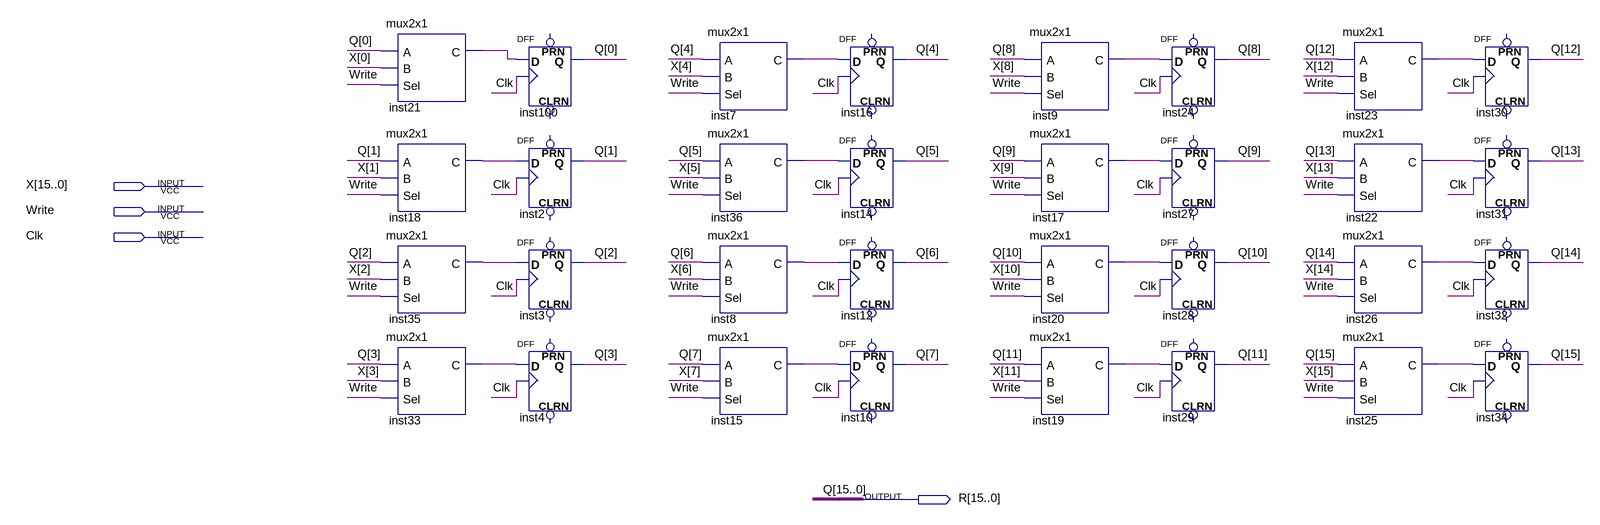
[diagram p0: schematic sheet]
// Quartus schematic reg2.bdf as structural Verilog: 32 symbols, 4 pins
module reg2 (
  input  [15:0] X,
  input  Write,
  input  Clk,
  output [15:0] R
);

  wire inst7_c, inst8_c, inst9_c, inst15_c, inst17_c, inst18_c, inst19_c, inst20_c, inst21_c, inst22_c,
       inst23_c, inst25_c, inst26_c, inst33_c, inst35_c, inst36_c;

  mux2x1 inst21 (.A(R[0]), .B(X[0]), .Sel(Write), .C(inst21_c));
  mux2x1 inst18 (.A(R[1]), .B(X[1]), .Sel(Write), .C(inst18_c));
  mux2x1 inst35 (.A(R[2]), .B(X[2]), .Sel(Write), .C(inst35_c));
  mux2x1 inst33 (.A(R[3]), .B(X[3]), .Sel(Write), .C(inst33_c));
  DFF inst100 (.CLK(Clk), .D(inst21_c), .Q(R[0]));  // open: CLRN, PRN
  DFF inst2 (.CLK(Clk), .D(inst18_c), .Q(R[1]));  // open: CLRN, PRN
  DFF inst3 (.CLK(Clk), .D(inst35_c), .Q(R[2]));  // open: CLRN, PRN
  DFF inst4 (.CLK(Clk), .D(inst33_c), .Q(R[3]));  // open: CLRN, PRN
  mux2x1 inst7 (.A(R[4]), .B(X[4]), .Sel(Write), .C(inst7_c));
  mux2x1 inst36 (.A(R[5]), .B(X[5]), .Sel(Write), .C(inst36_c));
  mux2x1 inst8 (.A(R[6]), .B(X[6]), .Sel(Write), .C(inst8_c));
  mux2x1 inst15 (.A(R[7]), .B(X[7]), .Sel(Write), .C(inst15_c));
  DFF inst16 (.CLK(Clk), .D(inst7_c), .Q(R[4]));  // open: CLRN, PRN
  DFF inst14 (.CLK(Clk), .D(inst36_c), .Q(R[5]));  // open: CLRN, PRN
  DFF inst12 (.CLK(Clk), .D(inst8_c), .Q(R[6]));  // open: CLRN, PRN
  DFF inst10 (.CLK(Clk), .D(inst15_c), .Q(R[7]));  // open: CLRN, PRN
  mux2x1 inst9 (.A(R[8]), .B(X[8]), .Sel(Write), .C(inst9_c));
  mux2x1 inst17 (.A(R[9]), .B(X[9]), .Sel(Write), .C(inst17_c));
  mux2x1 inst20 (.A(R[10]), .B(X[10]), .Sel(Write), .C(inst20_c));
  mux2x1 inst19 (.A(R[11]), .B(X[11]), .Sel(Write), .C(inst19_c));
  DFF inst24 (.CLK(Clk), .D(inst9_c), .Q(R[8]));  // open: CLRN, PRN
  DFF inst27 (.CLK(Clk), .D(inst17_c), .Q(R[9]));  // open: CLRN, PRN
  DFF inst28 (.CLK(Clk), .D(inst20_c), .Q(R[10]));  // open: CLRN, PRN
  DFF inst29 (.CLK(Clk), .D(inst19_c), .Q(R[11]));  // open: CLRN, PRN
  mux2x1 inst23 (.A(R[12]), .B(X[12]), .Sel(Write), .C(inst23_c));
  mux2x1 inst22 (.A(R[13]), .B(X[13]), .Sel(Write), .C(inst22_c));
  mux2x1 inst26 (.A(R[14]), .B(X[14]), .Sel(Write), .C(inst26_c));
  mux2x1 inst25 (.A(R[15]), .B(X[15]), .Sel(Write), .C(inst25_c));
  DFF inst30 (.CLK(Clk), .D(inst23_c), .Q(R[12]));  // open: CLRN, PRN
  DFF inst31 (.CLK(Clk), .D(inst22_c), .Q(R[13]));  // open: CLRN, PRN
  DFF inst32 (.CLK(Clk), .D(inst26_c), .Q(R[14]));  // open: CLRN, PRN
  DFF inst34 (.CLK(Clk), .D(inst25_c), .Q(R[15]));  // open: CLRN, PRN

  // Other names for the same wires on the sheet: Q[15:0] = R
endmodule
